# EAGLE design uNav4x4r1_PTH (EAGLE 6.5.0)
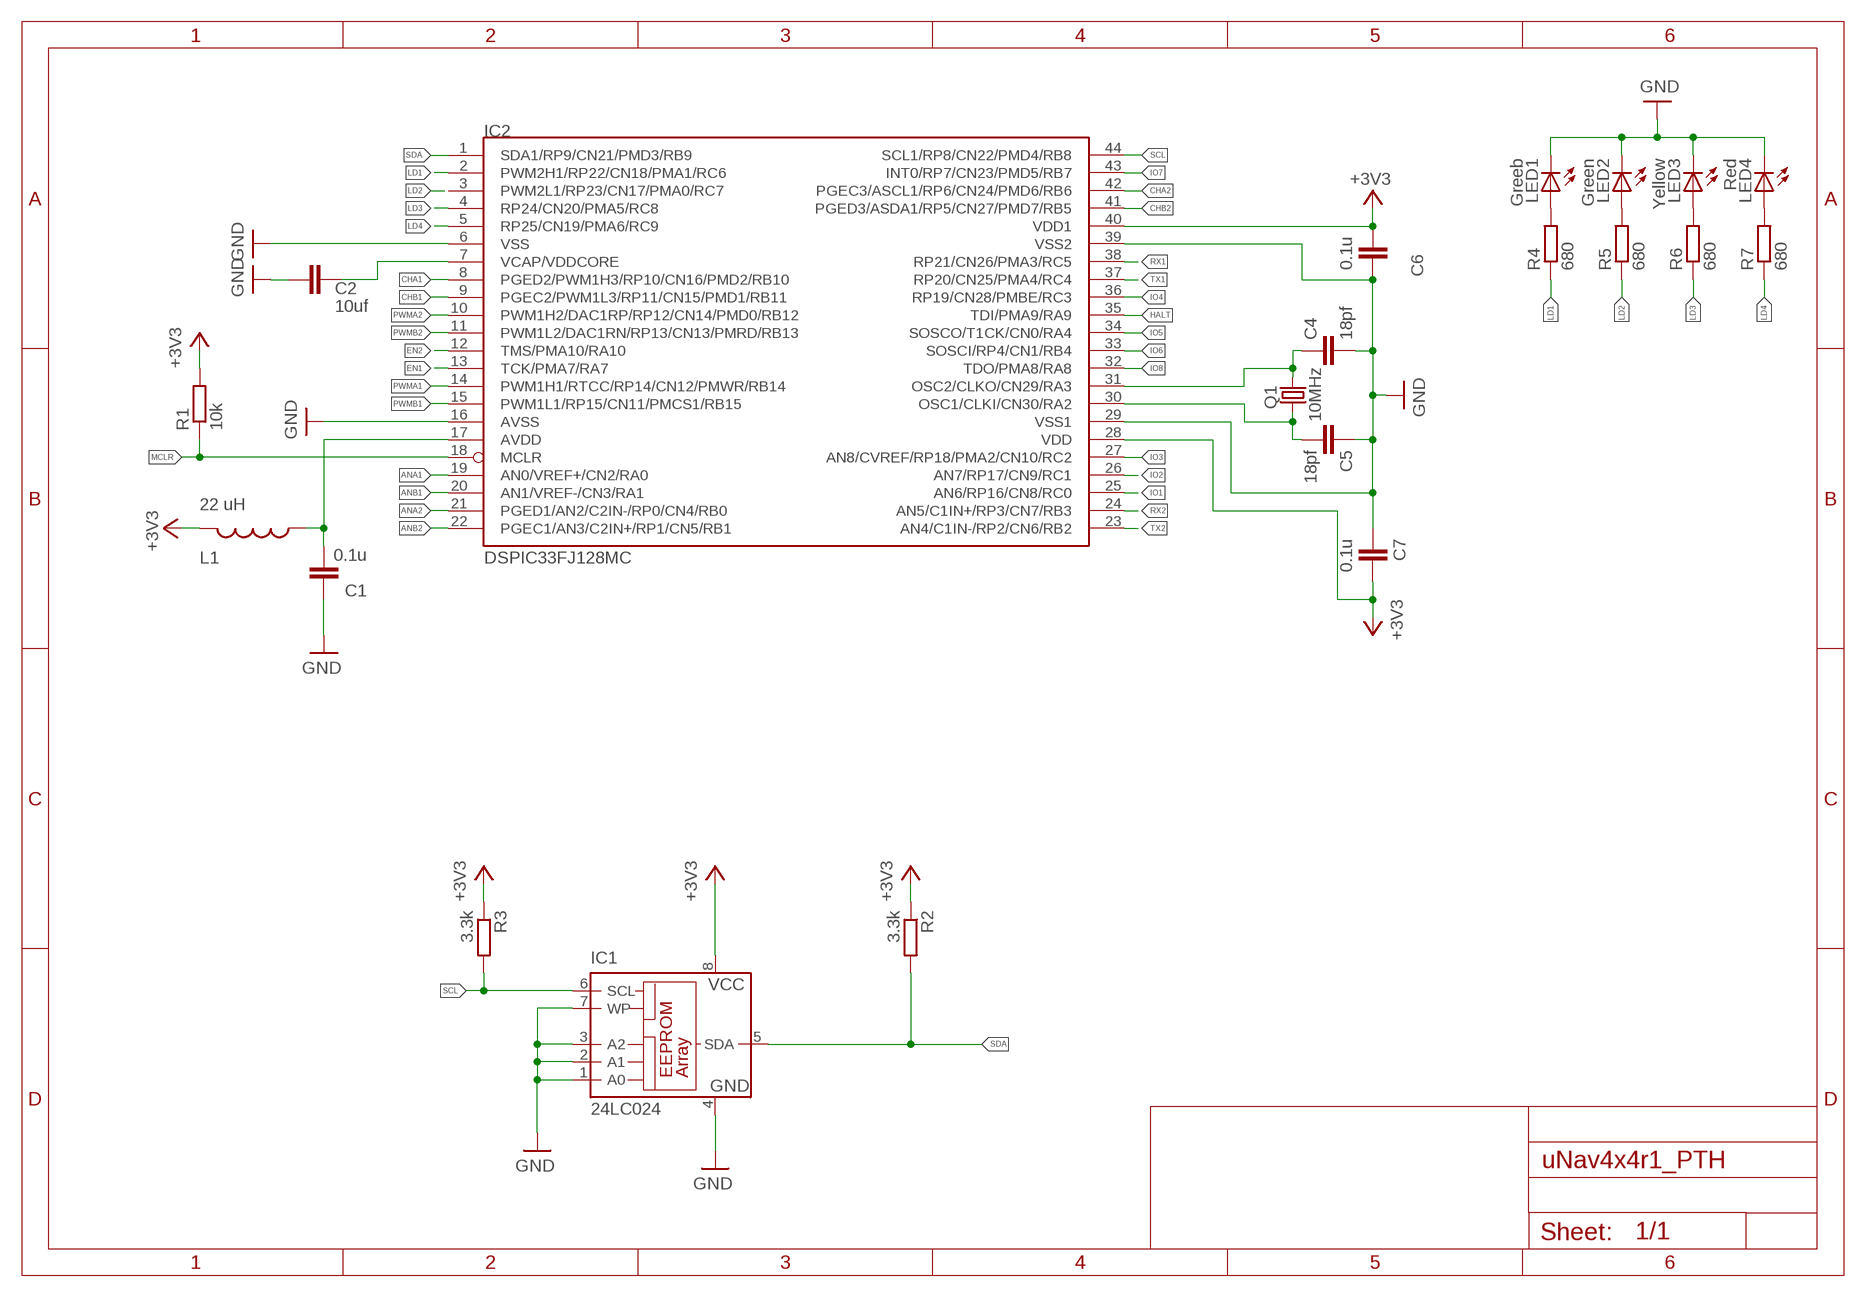
[diagram p0: schematic, sheet 1, part 1 of 2]
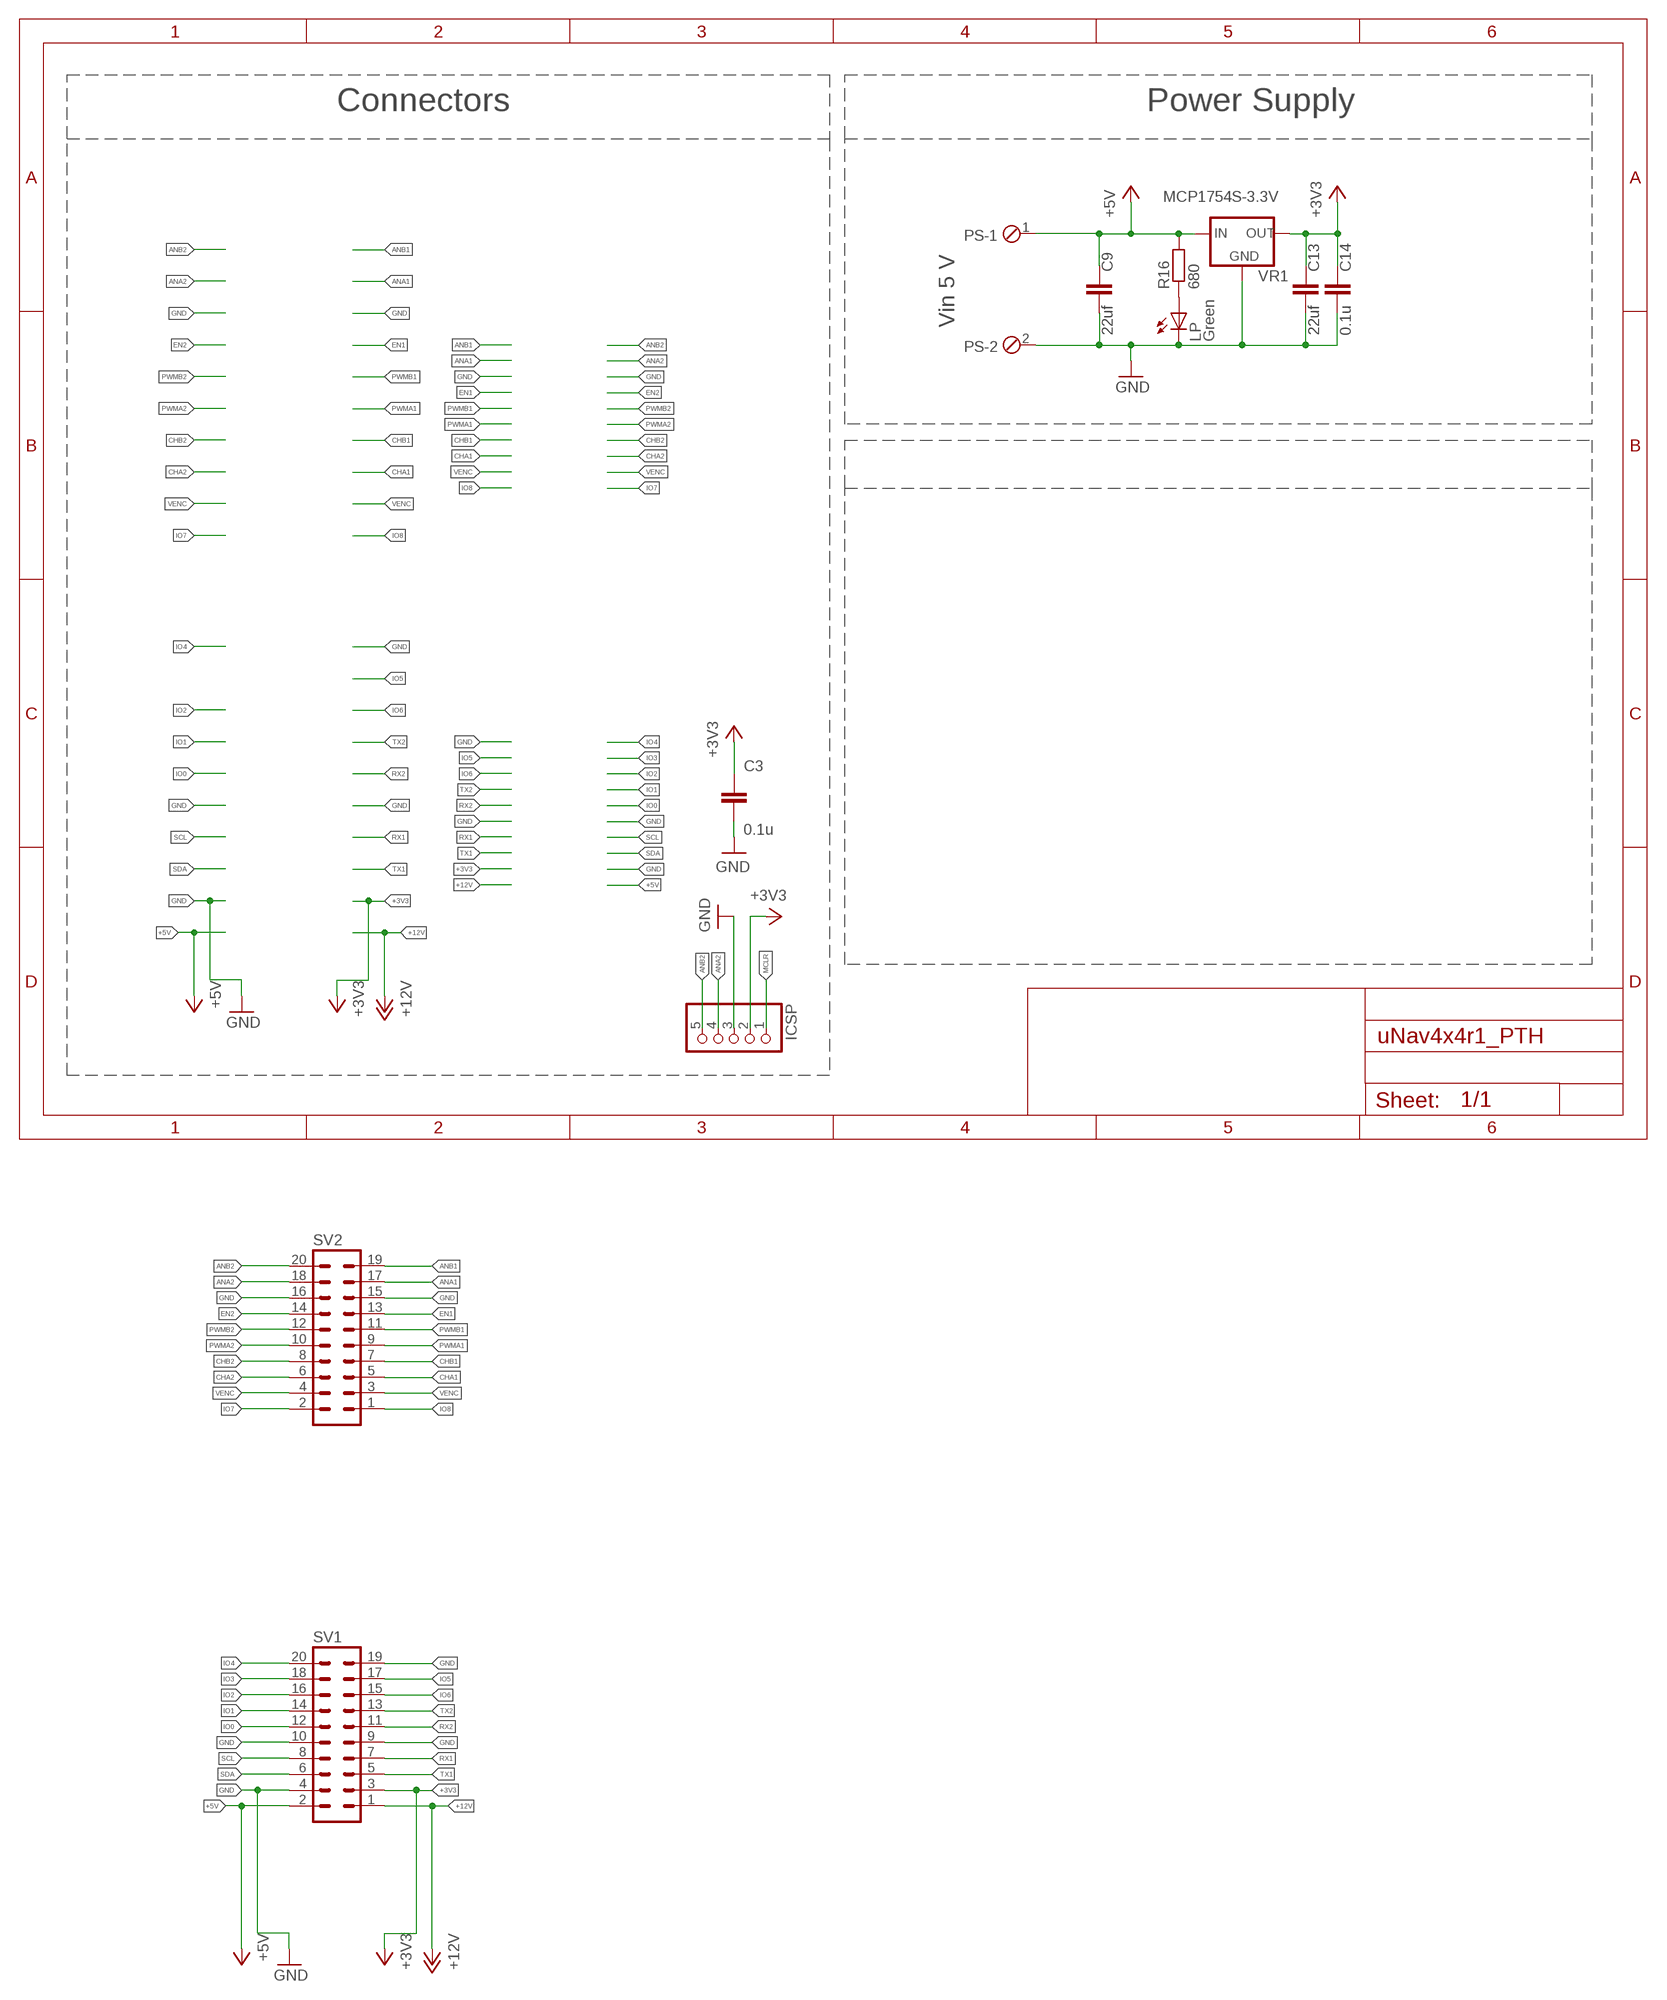
[diagram p1: schematic, sheet 1, part 2 of 2]

## Parts
C1  0.1u  C-EUC0603  [C0603]
C2  10uf  C-EUC1206  [C1206]
C3  0.1u  C-EUC0603  [C0603]
C4  18pf  C-EUC0603  [C0603]
C5  18pf  C-EUC0603  [C0603]
C6  0.1u  C-EUC0603  [C0603]
C7  0.1u  C-EUC0603  [C0603]
C9  22uf  C-EUC1206  [C1206]
C13  22uf  C-EUC1206  [C1206]
C14  0.1u  C-EUC0603  [C0603]
IC1  24LC024  24AA01SM  [SO-08M]
IC2  DSPIC33FJ128MC  DSPIC33FJ128MC804-PT  [TQFP44]
ICSP  PINHD-1X05_2.54-S  [1X05-S]
L1  22 uH  INDUCTOR0805  [0805]
LED1  Greeb  LEDCHIPLED_0805  [CHIPLED_0805]
LED2  Green  LEDCHIPLED_0805  [CHIPLED_0805]
LED3  Yellow  LEDCHIPLED_0805  [CHIPLED_0805]
LED4  Red  LEDCHIPLED_0805  [CHIPLED_0805]
LP  Green  LEDCHIPLED_0805  [CHIPLED_0805]
PS  MPT2  [2POL254]
Q1  10MHz  CRYSTALHC49U-V  [HC49U-V]
R1  10k  R-EU_R0603  [R0603]
R2  3.3k  R-EU_R0603  [R0603]
R3  3.3k  R-EU_R0603  [R0603]
R4  680  R-EU_R0603  [R0603]
R5  680  R-EU_R0603  [R0603]
R6  680  R-EU_R0603  [R0603]
R7  680  R-EU_R0603  [R0603]
R16  680  R-EU_R0603  [R0603]
SV1  MA10-2  [MA10-2]
SV2  MA10-2  [MA10-2]
VR1  MCP1754S-3.3V  MCP1754S  [SOT89]

## Nets
+3V3: C3.1 C6.2 C7.1 C13.1 C14.1 IC1.8(VCC) IC2.28(VDD) IC2.40(VDD1) ICSP.2 L1.2 R1.2 R2.1 R3.1 SV1.3 VR1.3(OUT)
+5V: C9.1 PS.1 R16.2 SV1.2 VR1.1(IN)
+12V: SV1.1
ANA1: IC2.19(AN0/VREF+/CN2/RA0) SV2.17
ANA2: IC2.21(PGED1/AN2/C2IN-/RP0/CN4/RB0) ICSP.4 SV2.18
ANB1: IC2.20(AN1/VREF-/CN3/RA1) SV2.19
ANB2: IC2.22(PGEC1/AN3/C2IN+/RP1/CN5/RB1) ICSP.5 SV2.20
AVDD: C1.2 IC2.17(AVDD) L1.1
CHA1: IC2.8(PGED2/PWM1H3/RP10/CN16/PMD2/RB10) SV2.5
CHA2: IC2.42(PGEC3/ASCL1/RP6/CN24/PMD6/RB6) SV2.6
CHB1: IC2.9(PGEC2/PWM1L3/RP11/CN15/PMD1/RB11) SV2.7
CHB2: IC2.41(PGED3/ASDA1/RP5/CN27/PMD7/RB5) SV2.8
EN1: IC2.13(TCK/PMA7/RA7) SV2.13
EN2: IC2.12(TMS/PMA10/RA10) SV2.14
GND: C1.1 C2.2 C3.2 C4.2 C5.1 C6.1 C7.2 C9.2 C13.2 C14.2 IC1.1(A0) IC1.2(A1) IC1.3(A2) IC1.4(GND) IC1.7(WP) IC2.6(VSS) IC2.16(AVSS) IC2.29(VSS1) IC2.39(VSS2) ICSP.3 LED1.C LED2.C LED3.C LED4.C LP.C PS.2 SV1.4 SV1.9 SV1.10 SV1.19 SV2.15 SV2.16 VR1.2(GND) VR1.4(GND)
HALT: IC2.35(TDI/PMA9/RA9)
IO0: SV1.12
IO1: IC2.25(AN6/RP16/CN8/RC0) SV1.14
IO2: IC2.26(AN7/RP17/CN9/RC1) SV1.16
IO3: IC2.27(AN8/CVREF/RP18/PMA2/CN10/RC2) SV1.18
IO4: IC2.36(RP19/CN28/PMBE/RC3) SV1.20
IO5: IC2.34(SOSCO/T1CK/CN0/RA4) SV1.17
IO6: IC2.33(SOSCI/RP4/CN1/RB4) SV1.15
IO7: IC2.43(INT0/RP7/CN23/PMD5/RB7) SV2.2
IO8: IC2.32(TDO/PMA8/RA8) SV2.1
LD1: IC2.2(PWM2H1/RP22/CN18/PMA1/RC6) R4.1
LD2: IC2.3(PWM2L1/RP23/CN17/PMA0/RC7) R5.1
LD3: IC2.4(RP24/CN20/PMA5/RC8) R6.1
LD4: IC2.5(RP25/CN19/PMA6/RC9) R7.1
MCLR: IC2.18(MCLR) ICSP.1 R1.1
N$2: C5.2 IC2.30(OSC1/CLKI/CN30/RA2) Q1.1
N$3: C4.1 IC2.31(OSC2/CLKO/CN29/RA3) Q1.2
N$5: LP.A R16.1
N$12: LED1.A R4.2
N$13: LED2.A R5.2
N$14: LED3.A R6.2
N$15: LED4.A R7.2
PWMA1: IC2.14(PWM1H1/RTCC/RP14/CN12/PMWR/RB14) SV2.9
PWMA2: IC2.10(PWM1H2/DAC1RP/RP12/CN14/PMD0/RB12) SV2.10
PWMB1: IC2.15(PWM1L1/RP15/CN11/PMCS1/RB15) SV2.11
PWMB2: IC2.11(PWM1L2/DAC1RN/RP13/CN13/PMRD/RB13) SV2.12
RX1: IC2.38(RP21/CN26/PMA3/RC5) SV1.7
RX2: IC2.24(AN5/C1IN+/RP3/CN7/RB3) SV1.11
SCL: IC1.6(SCL) IC2.44(SCL1/RP8/CN22/PMD4/RB8) R3.2 SV1.8
SDA: IC1.5(SDA) IC2.1(SDA1/RP9/CN21/PMD3/RB9) R2.2 SV1.6
TX1: IC2.37(RP20/CN25/PMA4/RC4) SV1.5
TX2: IC2.23(AN4/C1IN-/RP2/CN6/RB2) SV1.13
VCAP/VDDCORE: C2.1 IC2.7(VCAP/VDDCORE)
VENC: SV2.3 SV2.4

## Notes on the sheet
- Connectors | Power Supply
- Vin 5 V

## Library data of the parts
C1-C7 C9 C13 C14 = rcl:C-EU: CAPACITOR, European symbol
IC1 = microchip:24*: Serial EEPROM I2C; MF: MICROCHIP; MPN: 24AA01-I/SN; OC_FARNELL: 1331268; OC_NEWARK: 92C6793
IC2 = microchip-dspic33fjxxmc:DSPIC33FJ128MC804: dsPIC33FJ32MC302/304, dsPIC33FJ64MCX02/X04, AND dsPIC33FJ128MCX02/X04 High-Performance, 16-bit Digital Signal Controllers Package:44 Pin TQFP Operating Range: * Up to 40 MIPS operation (at 3.0V -3.6V): - Industrial temperature range (-40°C to +85°C) - Extended temperature range (-40°C to +125°C) High-Performance DSC CPU: * Modified Harvard architecture * C compiler optimized instruction set * 16-bit wide data path * 24-bit wide instructions * Linear program memory addressing up to 4M instruction words * Linear data memory addressing up to 64 Kbytes * 83 base instructions: mostly 1 word/1 cycle * Two 40-bit accumulators with rounding and saturation options * Flexible and powerful addressing modes: - Indirect - Modulo - Bit-Reversed * Software stack * 16 x 16 fractional/integer multiply operations * 32/16 and 16/16 divide operations * Single-cycle multiply and accumulate: - Accumulator write back for DSP operations - Dual data fetch * Up to ±16-bit shifts for up to 40-bit data Direct Memory Access (DMA): * 8-channel hardware DMA * Up to 2 Kbytes dual ported DMA buffer area (DMA RAM) to store data transferred via DMA: - Allows data transfer between RAM and a peripheral while CPU is executing code (no cycle stealing) * Most peripherals support DMA Timers/Capture/Compare/PWM: * Timer/Counters, up to five 16-bit timers: - Can pair up to make two 32-bit timers - One timer runs as a Real-Time Clock with an external 32.768 kHz oscillator - Programmable prescaler * Input Capture (up to four channels): - Capture on up, down or both edges - 16-bit capture input functions - 4-deep FIFO on each capture * Output Compare (up to four channels): - Single or Dual 16-bit Compare mode - 16-bit Glitchless PWM mode * Hardware Real-Time Clock/Calendar (RTCC): - Provides clock, calendar, and alarm functions Interrupt Controller: * 5-cycle latency * Up to 53 available interrupt sources * Up to three external interrupts * Seven programmable priority levels * Five processor exceptions Digital I/O: * Peripheral pin Select functionality * Up to 35 programmable digital I/O pins * Wake-up/Interrupt-on-Change for up to 31 pins * Output pins can drive from 3.0V to 3.6V * Up to 5V output with open drain configuration * All digital input pins are 5V tolerant * 4 mA sink on all I/O pins On-Chip Flash and SRAM: * Flash program memory (up to 128 Kbytes) * Data SRAM (up to 16 Kbytes) * Boot, Secure, and General Security for program Flash System Management: * Flexible clock options: - External, crystal, resonator, internal RC - Fully integrated Phase-Locked Loop (PLL) - Extremely low jitter PLL * Power-up Timer * Oscillator Start-up Timer/Stabilizer * Watchdog Timer with its own RC oscillator * Fail-Safe Clock Monitor * Reset by multiple sources Power Management: * On-chip 2.5V voltage regulator * Switch between clock sources in real time * Idle, Sleep, and Doze modes with fast wake-up Analog-to-Digital Converters (ADCs): * 10-bit, 1.1 Msps or 12-bit, 500 Ksps conversion: - Two and four simultaneous samples (10-bit ADC) - Up to nine input channels with auto-scanning - Conversion start can be manual or synchronized with one of four trigger sources - Conversion possible in Sleep mode - ±2 LSb max integral nonlinearity - ±1 LSb max differential nonlinearity Audio Digital-to-Analog Converter (DAC): - 16-bit Dual Channel DAC module - 100 Ksps maximum sampling rate - Second-Order Digital Delta-Sigma Modulator Comparator Module: * Two analog comparators with programmable input/output configuration CMOS Flash Technology: * Low-power, high-speed Flash technology * Fully static design * 3.3V (±10%) operating voltage * Industrial and Extended temperature * Low power consumption Motor Control Peripherals: * 6-channel 16-bit Motor Control PWM: - Three duty cycle generators - Independent or Complementary mode - Programmable dead-time and output polarity - Edge-aligned or center-aligned - Manual output override control - One Fault input - Trigger for ADC conversions - PWM frequency for 16-bit resolution (@ 40 MIPS) = 1220 Hz for Edge-Aligned mode, 610 Hz for Center-Aligned mode - PWM frequency for 11-bit resolution (@ 40 MIPS) = 39.1 kHz for Edge-Aligned mode, 19.55 kHz for Center-Aligned mode * 2-channel 16-bit Motor Control PWM: - One duty cycle generator - Independent or Complementary mode - Programmable dead time and output polarity - Edge-aligned or center-aligned - Manual output override control - One Fault input - Trigger for ADC conversions - PWM frequency for 16-bit resolution (@ 40 MIPS) = 1220 Hz for Edge-Aligned mode, 610 Hz for Center-Aligned mode - PWM frequency for 11-bit resolution (@ 40 MIPS) = 39.1 kHz for Edge-Aligned mode, 19.55 kHz for Center-Aligned mode * 2-Quadrature Encoder Interface module: - Phase A, Phase B, and index pulse input - 16-bit up/down position counter - Count direction status - Position Measurement (x2 and x4) mode - Programmable digital noise filters on inputs - Alternate 16-bit Timer/Counter mode - Interrupt on position counter rollover/underflow
ICSP = pinhead-2:PINHD-1X05: PIN HEADER
L1 = SparkFun-Passives:INDUCTOR: Inductors Basic Inductor/Choke - 0603 and 1206. Footprints are not proven and vary greatly between part numbers. SRN6045- 33uH, 20% 1.4A SDR0403-560KL - 56uH, 10%, 500mA RMS/740mA peak
LED1-LED4 LP = led:LED: LED OSRAM: - CHIPLED LG R971, LG N971, LY N971, LG Q971, LY Q971, LO R971, LY R971 LH N974, LH R974 LS Q976, LO Q976, LY Q976 LO Q996 - Hyper CHIPLED LW Q18S LB Q993, LB Q99A, LB R99A - SideLED LS A670, LO A670, LY A670, LG A670, LP A670 LB A673, LV A673, LT A673, LW A673 LH A674 LY A675 LS A676, LA A676, LO A676, LY A676, LW A676 LS A679, LY A679, LG A679 - Hyper Micro SIDELED® LS Y876, LA Y876, LO Y876, LY Y876 LT Y87S - SmartLED LW L88C, LW L88S LB L89C, LB L89S, LG L890 LS L89K, LO L89K, LY L89K LS L896, LA L896, LO L896, LY L896 - TOPLED LS T670, LO T670, LY T670, LG T670, LP T670 LSG T670, LSP T670, LSY T670, LOP T670, LYG T670 LG T671, LOG T671, LSG T671 LB T673, LV T673, LT T673, LW T673 LH T674 LS T676, LA T676, LO T676, LY T676, LB T676, LH T676, LSB T676, LW T676 LB T67C, LV T67C, LT T67C, LS T67K, LO T67K, LY T67K, LW E67C LS E67B, LA E67B, LO E67B, LY E67B, LB E67C, LV E67C, LT E67C LW T67C LS T679, LY T679, LG T679 LS T770, LO T770, LY T770, LG T770, LP T770 LB T773, LV T773, LT T773, LW T773 LH T774 LS E675, LA E675, LY E675, LS T675 LS T776, LA T776, LO T776, LY T776, LB T776 LHGB T686 LT T68C, LB T68C - Hyper Mini TOPLED® LB M676 - Mini TOPLED Santana® LG M470 LS M47K, LO M47K, LY M47K Source: http://www.osram.convergy.de LUXEON: - LUMILED® LXK2-PW12-R00, LXK2-PW12-S00, LXK2-PW14-U00, LXK2-PW14-V00 LXK2-PM12-R00, LXK2-PM12-S00, LXK2-PM14-U00 LXK2-PE12-Q00, LXK2-PE12-R00, LXK2-PE12-S00, LXK2-PE14-T00, LXK2-PE14-U00 LXK2-PB12-K00, LXK2-PB12-L00, LXK2-PB12-M00, LXK2-PB14-N00, LXK2-PB14-P00, LXK2-PB14-Q00 LXK2-PR12-L00, LXK2-PR12-M00, LXK2-PR14-Q00, LXK2-PR14-R00 LXK2-PD12-Q00, LXK2-PD12-R00, LXK2-PD12-S00 LXK2-PH12-R00, LXK2-PH12-S00 LXK2-PL12-P00, LXK2-PL12-Q00, LXK2-PL12-R00 Source: www.luxeon.com KINGBRIGHT: KA-3528ASYC Source: www.kingbright.com
PS = Personale:MPT2: PHOENIX CONNECTOR
Q1 = crystal:CRYSTAL: CRYSTAL; OC_FARNELL: 1666969; OC_NEWARK: unknown
R1-R7 R16 = rcl:R-EU_: RESISTOR, European symbol
SV1 SV2 = con-lstb:MA10-2: PIN HEADER; OC_FARNELL: unknown; OC_NEWARK: unknown
VR1 = Personale:MCP1754S

## Net classes
0 default: width 0.203 mm, clearance 0.203 mm
1 power: width 0.305 mm, clearance 0.203 mm

## Board
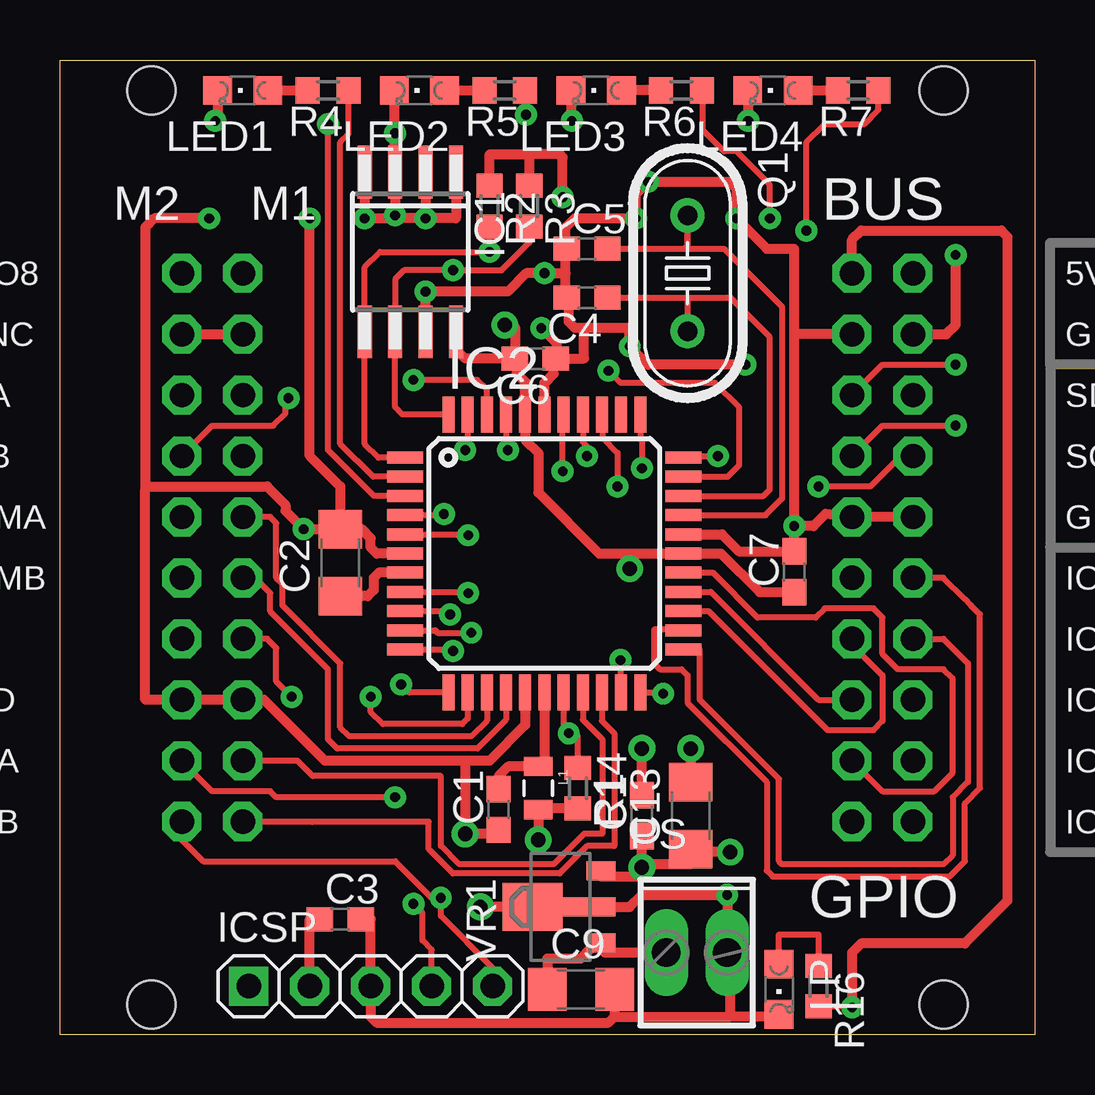
[diagram p2: board, top side]
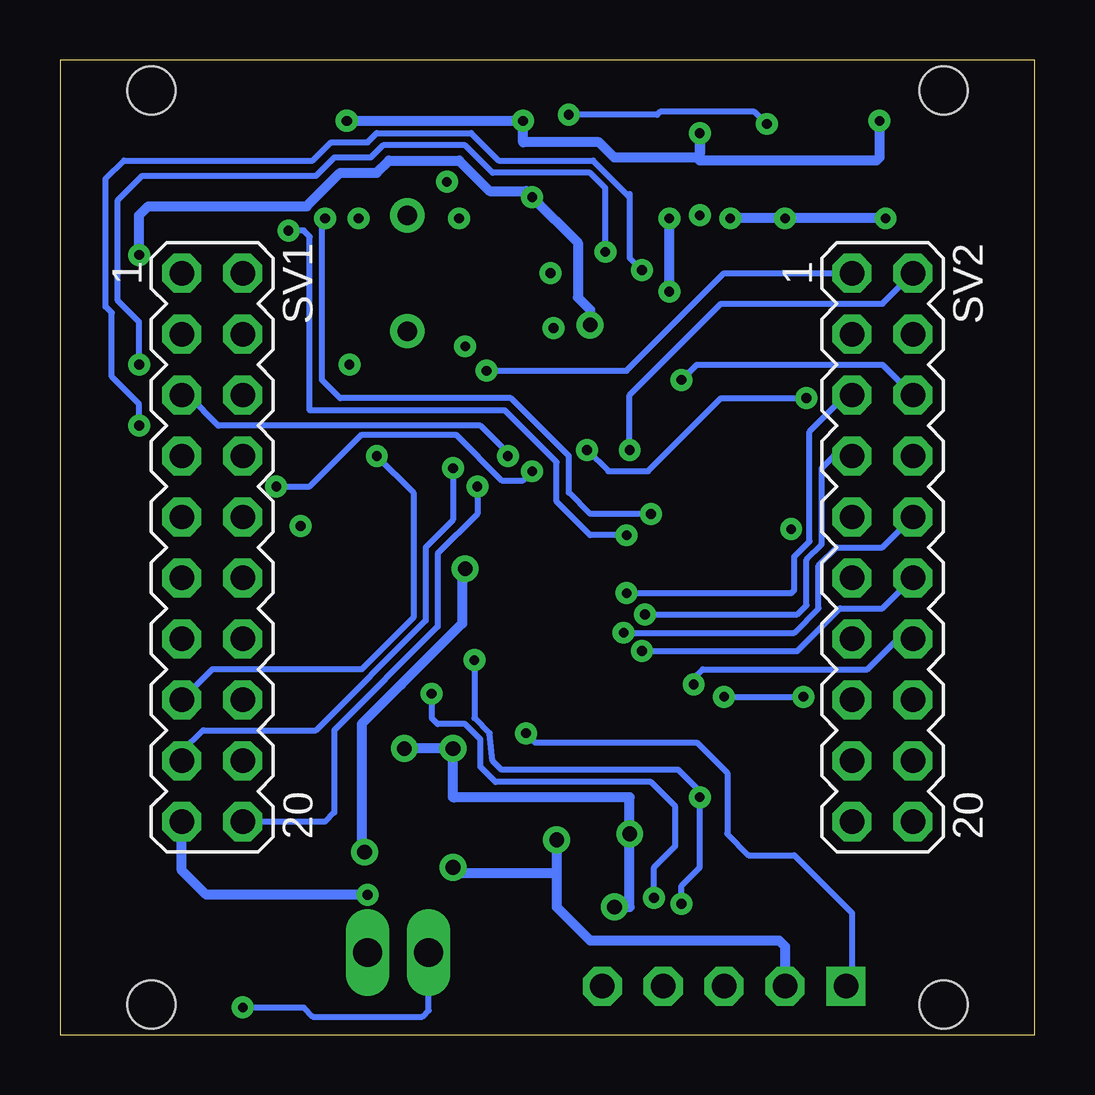
[diagram p3: board, bottom side, seen from below]

Size 40.64 x 40.64 mm. Coordinates in mm from the lower left corner, seen from the top.
Outline: 40.64,40.64 40.64,0 0,0 0,40.64 40.64,40.64
Copper layers (1*16): Top 0.035mm / dielectric 1.5mm / Bottom 0.035mm
Design rules "default": minimum track width 8mil, minimum drill 20mil, track to track 8mil, track to pad 8mil, pad to pad 8mil, via to via 8mil, smd to smd 8mil, copper to edge 10mil, drill to drill 8mil, minimum pad ring 12mil, minimum via ring 10mil, stop-mask expansion 4mil, vias tented up to drill 20mil, thermal gap 10mil
Holes 2 mm at 3.81,39.37 36.83,1.27 36.83,39.37 3.81,1.27
tRestrict: area -0.3,-1.9 to 42.9,0.6; area -0.3,41.9 to 42.9,44.5; area -1.9,0 to 0.6,43.2; area 41.6,0 to 44.1,43.2
bRestrict: area -1.9,0 to 0.6,43.2; area 41.6,0 to 44.1,43.2; area -0.3,-1.9 to 42.9,0.6; area -0.3,41.9 to 42.9,44.5

### Footprints (pad centres in the part's own frame; a part is rotated, then mirrored left to right if it is on the bottom)
C0603 = smd 1.1 x 1: 1 -0.85,0; 2 0.85,0
C1206 = smd 1.6 x 1.8: 1 -1.4,0; 2 1.4,0
SO-08M = smd 0.6 x 2.2: 1 -1.905,-3.33; 2 -0.635,-3.33; 3 0.635,-3.33; 4 1.905,-3.33; 5 1.905,3.33; 6 0.635,3.33; 7 -0.635,3.33; 8 -1.905,3.33
TQFP44 = smd 1.5 x 0.5: 1 -5.8,4; 2 -5.8,3.2; 3 -5.8,2.4; 4 -5.8,1.6; 5 -5.8,0.8; 6 -5.8,0; 7 -5.8,-0.8; 8 -5.8,-1.6; 9 -5.8,-2.4; 10 -5.8,-3.2; 11 -5.8,-4; 23 5.8,-4; 24 5.8,-3.2; 25 5.8,-2.4; 26 5.8,-1.6; 27 5.8,-0.8; 28 5.8,0; 29 5.8,0.8; 30 5.8,1.6; 31 5.8,2.4; 32 5.8,3.2; 33 5.8,4 | smd 0.5 x 1.5: 12 -4,-5.8; 13 -3.2,-5.8; 14 -2.4,-5.8; 15 -1.6,-5.8; 16 -0.8,-5.8; 17 0,-5.8; 18 0.8,-5.8; 19 1.6,-5.8; 20 2.4,-5.8; 21 3.2,-5.8; 22 4,-5.8; 34 4,5.8; 35 3.2,5.8; 36 2.4,5.8; 37 1.6,5.8; 38 0.8,5.8; 39 0,5.8; 40 -0.8,5.8; 41 -1.6,5.8; 42 -2.4,5.8; 43 -3.2,5.8; 44 -4,5.8
1X05-S = drill 1.016 square: 1 -5.08,0 | drill 1.016 octagon: 2 -2.54,0; 3 0,0; 4 2.54,0; 5 5.08,0
0805 = smd 0.8 x 1.2: 1 -0.9,0; 2 0.9,0
CHIPLED_0805 = smd 1.2 x 1.2: A 0,-1.05; C 0,1.05
2POL254 = drill 1.2 long: 1 -1.27,0; 2 1.27,0
HC49U-V = drill 0.813: 1 -2.413,0; 2 2.413,0
R0603 = smd 1 x 1.1: 1 -0.85,0; 2 0.85,0
MA10-2 = drill 1.016 octagon: 1 -11.43,-1.27; 2 -11.43,1.27; 3 -8.89,-1.27; 4 -8.89,1.27; 5 -6.35,-1.27; 6 -6.35,1.27; 7 -3.81,-1.27; 8 -3.81,1.27; 9 -1.27,-1.27; 10 -1.27,1.27; 11 1.27,-1.27; 12 1.27,1.27; 13 3.81,-1.27; 14 3.81,1.27; 15 6.35,-1.27; 16 6.35,1.27; 17 8.89,-1.27; 18 8.89,1.27; 19 11.43,-1.27; 20 11.43,1.27
SOT89 = smd 0.8 x 1.2: 1 -1.5,-1.6; 3 1.5,-1.6 | smd 0.8 x 2.3: 2 0,-1.05 | smd 2 x 2.5: 4 0,1.25

### Placement (x,y rotation side)
C1  18.29,9.4 90 top
C2  11.68,19.68 90 top
C3  11.68,4.83 0 top
C4  21.97,30.73 180 top
C5  21.97,32.77 0 top
C6  19.81,28.19 180 top
C7  30.61,19.3 90 top
C9  21.72,1.91 0 top
C13  26.29,9.14 90 top
C14  24.26,9.14 90 top
IC1  14.61,32.64 180 top
IC2  20.19,20.07 0 top
ICSP  12.95,2.03 0 top
L1  19.94,10.29 270 top
LED1  7.62,39.37 90 top
LED2  14.99,39.37 90 top
LED3  22.35,39.37 90 top
LED4  29.72,39.37 90 top
LP  29.97,1.91 180 top
PS  26.54,3.43 0 top
Q1  26.16,31.75 270 top
R1  21.59,10.29 270 top
R2  17.91,34.54 270 top
R3  19.56,34.54 270 top
R4  11.18,39.37 180 top
R5  18.54,39.37 180 top
R6  25.91,39.37 180 top
R7  33.27,39.37 180 top
R16  31.62,2.03 270 top
SV1  34.29,20.32 270 bottom
SV2  6.35,20.32 270 bottom
VR1  20.95,5.33 90 top

### Tracks (layer width: path | path; a pad name or v marks a point on that pad's centre or on a via)
+3V3  (via drill 0.41, 0.61)
  Top 0.254: R2.1 17.95,35.43
  Top 0.406: C6.2 19.05,28.11 19.05,27.56 19.39,27.22 IC2.40 19.39,24.8 19.94,24.26 19.94,22.61 22.48,20.07 23.75,20.07 | C6.2 16.89,28.19 16.51,28.57 IC1.8 | 24.26,7.11 26.29,7.11 C13.1 26.41,7.62 v27.94,7.62 | 24.26,7.11 C14.1 v24.26,6.99 | VR1.3 22.55,6.6 24.26,6.6 v24.26,6.99 | v24.26,6.99 24.26,7.11 | R2.1 17.91,36.7 19.56,36.7 | 19.56,36.7 R3.1 | R1.2 19.99,9.44 L1.2 v19.94,8.13 | ICSP.2 10.41,4.83 C3.1 | 23.75,20.07 IC2.28 27.56,20.07 29.17,18.45 C7.1 | v20.95,34.92 20.95,36.58 20.83,36.7 19.56,36.7 | v18.54,29.59 18.96,29.5 C6.2 | 23.75,20.07 v23.75,19.43 | SV1.3 36.96,29.21 37.34,29.59 v37.34,32.51
  Bottom 0.406: v19.94,8.13 19.94,6.86 | 19.94,6.86 20.07,6.73 24,6.73 v24.26,6.99 | v18.54,29.59 18.54,30.23 19.05,30.73 19.05,33.02 v20.95,34.92 21.21,35.18 22.73,35.18 24,36.45 26.92,36.45 27.43,35.94 28.96,35.94 30.35,34.54 36.96,34.54 37.34,34.16 v37.34,32.51 | 19.94,6.86 19.94,5.33 18.54,3.94 10.67,3.94 10.41,3.68 ICSP.2 | v23.75,19.43 23.88,19.43 23.88,17.14 26.42,14.61 28.07,12.95 28.07,7.75 v27.94,7.62
+5V  (via drill 0.41)
  Top 0.254: R16.2 32.98,1.18 v33.02,1.14
  Top 0.406: C9.1 20.32,1.53 20.32,3.17 21.72,3.17 22.12,3.58 VR1.1 22.71,3.43 PS.1 | SV1.2 33.02,33.15 33.4,33.53 39.24,33.53 39.5,33.27 39.5,5.59 37.72,3.81 33.4,3.81 33.02,3.43 v33.02,1.14
  Bottom 0.254: v33.02,1.14 30.48,1.14 30.1,0.76 25.53,0.76 25.27,1.02 PS.1
ANA1
  Top 0.254: IC2.19 21.79,13.13 22.61,12.32 22.61,8.38 21.84,8.38 20.57,7.11 16.64,7.11 15.88,7.87 15.88,10.79 10.54,10.79 9.91,11.43 SV2.17
ANA2  (via drill 0.41)
  Top 0.254: IC2.21 23.39,15.6 v23.37,15.62 | ICSP.4 15.49,3.56 15.11,3.94 15.11,5.08 v14.73,5.46 | v13.97,9.91 9.02,9.91 8.76,10.16 6.35,10.16 SV2.18
  Bottom 0.254: v23.37,15.62 23.37,13.21 22.73,12.57 22.61,11.43 22.23,11.05 14.86,11.05 13.97,10.16 v13.97,9.91 13.97,6.99 14.73,6.22 v14.73,5.46
ANB1
  Top 0.254: IC2.20 22.59,13.09 23.11,12.57 23.11,7.87 21.97,7.87 20.83,6.73 16.38,6.73 15.37,7.75 15.37,8.89 10.54,8.89 10.53,8.88 7.63,8.88 SV2.19
ANB2  (via drill 0.41)
  Top 0.254: IC2.22 25.1,14.27 v25.15,14.22 | ICSP.5 18.03,2.79 15.88,4.95 v15.88,5.71 15.49,5.71 13.97,7.24 5.97,7.24 5.08,8.13 SV2.20
  Bottom 0.254: v25.15,14.22 25.15,13.21 24.89,12.95 23.75,12.95 23.11,12.32 23.11,11.18 22.48,10.54 16,10.54 14.99,9.53 14.99,7.87 15.88,6.99 v15.88,5.71
AVDD
  Top 0.406: IC2.17 20.19,11.44 L1.1 18.68,11.19 18.29,10.79 C1.2
CHA1  (via drill 0.41)
  Top 0.254: IC2.8 16.94,18.47 v17.02,18.41
  Bottom 0.254: v17.02,18.41 10.16,18.41 10.03,18.54 10.03,19.94 9.4,20.57 9.4,25.15 7.87,26.67 SV2.5
CHA2  (via drill 0.41)
  Top 0.254: IC2.42 17.79,26.91 17.4,27.3 v14.73,27.3
  Bottom 0.254: SV2.6 6.35,27.94 14.1,27.94 v14.73,27.3
CHB1  (via drill 0.41)
  Top 0.254: IC2.9 16.12,17.67 v16.26,17.53
  Bottom 0.254: SV2.7 8.38,24.13 8.89,23.62 8.89,20.45 9.53,19.81 9.53,17.91 9.91,17.53 v16.26,17.53
CHB2  (via drill 0.41)
  Top 0.254: IC2.41 18.59,24.46 v18.67,24.38 | SV2.8 6.35,25.4 8.89,25.4 9.4,25.91 9.4,26.42 v9.53,26.54
  Bottom 0.254: v18.67,24.38 17.78,23.5 16.13,23.5 13.08,26.54 v9.53,26.54
EN1  (via drill 0.41)
  Top 0.254: IC2.13 16.99,13.18 16.76,12.95 13.46,12.95 12.95,13.46 v12.95,14.1 | v9.65,14.1 9.02,14.73 9.02,16.13 8.64,16.51 SV2.13
  Bottom 0.254: v12.95,14.1 v9.65,14.1
EN2  (via drill 0.41)
  Top 0.254: IC2.12 14.56,14.27 v14.22,14.61
  Bottom 0.254: v14.22,14.61 14.22,14.86 13.84,15.24 6.99,15.24 5.71,16.51 SV2.14
GND  (via drill 0.41, 0.61)
  Top 0.254: C5.1 21.08,32.77 | 21.08,31.11 C4.2
  Top 0.406: v28.57,27.94 24.51,27.94 v23.75,28.7 23.75,29.46 21.84,29.46 | 21.84,29.46 21.46,29.46 21.21,29.72 21.21,30.99 21.08,31.11 21.08,31.75 | 21.08,31.75 21.08,32.77 21.08,33.66 21.46,34.04 v24,34.04 24,35.05 v24.51,35.56 27.94,35.56 28.19,35.31 v28.19,34.04 29.46,32.77 30.61,32.77 30.61,29.21 | v13.97,34.16 IC1.3 13.94,36 13.94,38.1 | v13.97,34.16 13.97,34.04 | 13.97,34.04 14.1,34.04 | IC1.1 16.51,34.04 v15.24,34.04 15.11,34.04 | IC1.2 15.24,34.16 15.11,34.04 | IC1.4 v12.7,34.04 13.97,34.04 | LED1.C 6.57,38.35 v6.48,38.1 | LED2.C 13.94,38.1 | 13.94,38.1 v13.97,37.59 | LED3.C 21.3,38.1 v21.34,38.1 | LED4.C v28.67,38.1 v28.7,38.1 | IC2.29 27.6,20.87 28.31,20.15 C7.2 v30.61,21.21 | 21.08,31.75 v20.19,31.75 19.43,31.75 18.67,30.99 v15.24,30.99 IC1.7 | IC2.39 20.19,27.18 20.57,27.56 20.57,28.11 C6.1 | C6.1 21.84,28.19 21.84,29.46 | IC2.16 19.39,12.92 17.91,11.43 16.89,11.43 | 16.89,11.43 v16.89,8.38 17.78,8.38 C1.1 | C14.2 v24.26,11.94 | v26.29,11.94 C13.2 | 22.1,5.33 VR1.4 | VR1.4 VR1.2 21.88,5.37 21.97,5.21 22.1,5.33 | VR1.4 v17.53,5.33 | C9.2 23.12,0.76 | 23.12,0.76 27.94,0.76 | 27.94,0.76 27.94,3.43 PS.2 v27.81,5.84 24.26,5.84 23.75,5.33 22.1,5.33 | LP.C 29.97,0.76 27.94,0.76 | 15.11,34.04 14.1,34.04 | 14.1,34.04 v13.97,34.16 | v20.07,29.46 20.7,28.83 20.7,28.23 C6.1 | C3.2 12.95,4.83 ICSP.3 12.95,0.76 13.21,0.51 22.86,0.51 23.12,0.76 | 16.89,11.43 11.05,11.43 8.51,13.97 SV2.15 | SV2.15 SV2.16 | v10.41,34.04 10.41,24.13 11.68,22.86 C2.2 12.57,21.08 12.95,20.7 12.95,20.32 13.21,20.07 IC2.6 | SV2.15 3.56,13.97 3.56,22.73 | 3.56,22.73 3.68,22.86 8.64,22.86 9.4,22.1 9.4,21.84 v10.16,21.08 v10.16,21.09 C2.2
  Top 0.406: v6.22,34.04 3.94,34.04 3.56,33.66 3.56,22.73 | SV1.9 SV1.10 31.92,21.72 31.41,21.21 v30.61,21.21 | SV1.4 30.61,29.21 | v30.61,21.21 30.61,29.21
  Bottom 0.406: v26.29,11.94 v24.26,11.94 C14.2 24.17,9.91 | 24.17,9.91 16.89,9.91 v16.89,8.38 16.89,5.33 v17.53,5.33 | 24.26,9.91 24.17,9.91 | v15.24,30.99 v15.24,34.04 | v6.22,34.04 v10.41,34.04 v12.7,34.04 | v6.48,38.1 6.48,36.58 6.6,36.45 13.97,36.45 v13.97,37.59 13.97,36.7 14.1,36.58 17.53,36.58 18.16,37.21 21.34,37.21 v21.34,38.1 v28.67,38.1 | v27.81,5.84 34.54,5.84 35.56,6.86 SV1.19
IO1
  Top 0.254: SV1.14 33.02,16.26 34.29,14.99 34.29,13.08 33.91,12.7 32,12.7 27.04,17.67 IC2.25
IO2
  Top 0.254: IC2.26 27.13,18.47 31.62,13.97 SV1.16
IO3
  Top 0.254: SV1.18 34.29,10.16 36.45,10.16 37.21,10.92 37.21,14.86 36.83,15.24 34.92,15.24 34.29,15.88 34.29,17.4 33.91,17.78 31.88,17.78 31.5,17.4 29.08,17.4 27.22,19.27 IC2.27
IO4  (via drill 0.41)
  Top 0.254: IC2.36 22.61,25.85 22.61,24.89 23.24,24.26 v23.24,22.86
  Bottom 0.254: v23.24,22.86 23.24,21.72 24.89,20.07 24.89,17.02 29.21,12.7 29.21,9.27 29.59,8.89 SV1.20
IO5  (via drill 0.41)
  Top 0.254: IC2.34 24.19,24.83 24.26,24.77 v24.26,23.62
  Bottom 0.254: v24.26,23.62 24.26,21.46 25.4,20.32 25.4,17.27 29.97,12.7 34.67,12.7 35.56,11.81 SV1.17
IO6  (via drill 0.41)
  Top 0.254: IC2.33 25.99,24.09 25.82,24.09 25.78,24.13 v27.43,24.13
  Bottom 0.254: v27.43,24.13 25.91,22.61 25.91,17.4 28.07,15.24 34.29,15.24 SV1.15
IO7  (via drill 0.41)
  Top 0.254: IC2.43 16.99,24.49 v16.89,24.38
  Bottom 0.254: SV2.2 6.35,30.48 13.08,30.48 16.89,26.67 v16.89,24.38
IO8  (via drill 0.41)
  Top 0.254: IC2.32 27.84,23.27 28.32,23.75 28.32,26.16 27.3,27.18 23.37,27.18 v22.86,27.69
  Bottom 0.254: SV2.1 12.95,31.75 17.02,27.69 v22.86,27.69
LD1
  Top 0.254: IC2.2 13.06,23.27 11.68,24.64 11.68,37.21 12.03,37.55 R4.1
LD2  (via drill 0.41)
  Top 0.254: IC2.3 13.09,22.47 11.18,24.38 v11.18,37.97 | v19.43,38.35 19.39,38.39 R5.1
  Bottom 0.254: v11.18,37.97 11.68,38.48 15.62,38.48 15.75,38.35 v19.43,38.35
LD3  (via drill 0.41)
  Top 0.254: IC2.4 15.95,21.67 v16,21.72 | v29.59,34.04 29.59,35.43 28.19,36.83 27.69,36.83 26.8,37.72 26.8,39.33 R6.1
  Bottom 0.254: v16,21.72 18.54,21.72 19.43,22.61 19.43,24.13 21.84,26.54 28.96,26.54 29.72,27.3 29.72,33.91 v29.59,34.04
LD4  (via drill 0.41)
  Top 0.254: IC2.5 16.98,20.87 v17.02,20.83 | v31.11,33.53 31.11,37.21 31.88,37.97 33.53,37.97 34.12,38.57 R7.1
  Bottom 0.254: v17.02,20.83 18.54,20.83 19.94,22.23 19.94,23.88 22.1,26.04 30.23,26.04 30.23,33.27 30.48,33.53 v31.11,33.53
MCLR  (via drill 0.41)
  Top 0.254: IC2.18 20.99,12.79 v21.21,12.57 21.46,12.57 21.59,12.45 R1.1
  Bottom 0.254: v21.21,12.57 20.83,12.19 14.1,12.19 12.83,10.92 12.83,8.38 11.94,7.49 10.03,7.49 7.62,5.08 7.62,1.78 ICSP.1
N$2
  Top 0.254: C5.2 26.04,32.77 26.16,32.89 Q1.1 26.16,32.77 27.69,32.77 30.1,30.35 30.1,22.35 29.41,21.67 IC2.30
N$3
  Top 0.254: C4.1 26.16,30.73 | 26.16,30.73 Q1.2 | 26.16,30.73 27.94,30.73 29.59,29.08 29.59,22.73 29.32,22.47 IC2.31
N$5
  Top 0.254: LP.A 29.97,4.19 31.62,4.19 R16.1
N$12
  Top 0.406: LED1.A R4.2
N$13
  Top 0.406: LED2.A R5.2
N$14
  Top 0.406: R6.2 LED3.A
N$15
  Top 0.406: LED4.A R7.2
PWMA1
  Top 0.254: IC2.14 17.79,13.09 17.14,12.45 12.06,12.45 11.68,12.83 11.68,15.49 9.27,17.91 9.27,18.8 9.02,19.05 9.02,21.34 8.76,21.59 SV2.9
PWMA2  (via drill 0.41)
  Top 0.254: IC2.10 15.65,16.87 15.75,16.76 v17.14,16.76
  Bottom 0.254: v17.14,16.76 10.03,16.76 9.02,17.78 9.02,19.56 8.26,20.32 6.35,20.32 SV2.10
PWMB1
  Top 0.254: IC2.15 18.59,13.13 17.4,11.94 11.56,11.94 11.18,12.32 11.18,15.24 8.76,17.65 8.76,18.41 8.13,19.05 SV2.11
PWMB2  (via drill 0.41)
  Top 0.254: IC2.11 16.32,16.07 v16.38,16
  Bottom 0.254: v16.38,16 9.91,16 8.13,17.78 6.35,17.78 SV2.12
RX1  (via drill 0.41)
  Top 0.254: 35.69,24.13 SV1.7 35.05,24.13 33.78,22.86 v31.62,22.86 | v20.95,23.5 20.95,25.83 IC2.38
  Bottom 0.254: v31.62,22.86 30.23,22.86 28.07,25.02 24.13,25.02 22.23,23.11 21.34,23.11 v20.95,23.5
RX2
  Top 0.254: IC2.24 25.99,16.89 24.77,16.89 24.77,15.49 25.02,15.24 25.91,15.24 26.16,14.99 26.16,13.84 29.46,10.54 29.46,6.86 29.72,6.6 37.08,6.6 37.72,7.24 37.72,9.65 38.35,10.29 38.35,17.53 37.97,17.91 37.72,18.16 36.83,19.05 SV1.11
SCL  (via drill 0.41)
  Top 0.254: R3.2 19.56,33.02 18.41,31.88 v16.38,31.88 14.35,31.88 13.97,31.5 IC1.6 13.97,26.16 14.27,25.87 IC2.44 | SV1.8 34.29,25.4 v37.34,25.4
  Bottom 0.254: 16.89,34.92 18.41,36.45 22.35,36.45 23.5,37.59 27.43,37.59 27.81,37.21 29.34,37.21 30.1,36.45 37.97,36.45 38.73,35.69 38.73,30.35 38.48,30.1 38.48,27.43 37.34,26.29 v37.34,25.4 | 16.89,35.05 16.89,34.92 | 16.89,34.92 16.89,32.38 v16.38,31.88
SDA  (via drill 0.41)
  Top 0.254: R2.2 v17.91,32.64 13.34,32.64 12.7,32 IC1.5 12.7,24.64 13.27,24.07 IC2.1 | SV1.6 34.29,27.94 v37.34,27.94
  Bottom 0.254: v17.91,32.64 17.91,35.31 18.54,35.94 22.61,35.94 23.75,37.08 27.18,37.08 27.69,36.58 29.21,36.58 29.97,35.81 37.21,35.81 38.23,34.8 38.23,30.61 37.34,29.72 v37.34,27.94
TX1  (via drill 0.41)
  Top 0.254: IC2.37 21.79,24.71 21.97,24.51 v21.97,24.13
  Bottom 0.254: v21.97,24.13 21.97,24.26 23.11,25.4 34.04,25.4 35.31,26.67 SV1.5
TX2
  Top 0.254: SV1.13 36.83,16.51 37.85,15.49 37.85,10.54 37.21,9.91 37.21,7.49 36.83,7.11 30.1,7.11 29.97,7.24 29.97,10.67 26.67,13.97 26.67,16.07 IC2.23
VCAP/VDDCORE
  Top 0.406: IC2.7 13.3,19.27 13.08,19.05 13.08,18.54 12.83,18.29 C2.1
VENC
  Top 0.406: SV2.4 SV2.3

### Text on the board
tPlace: M2 | M1 | BUS | IO7 | IO8 | 5V | 12V | VENC | GND | 3v | CHA | SDA | TX1 | CHB | SCL | RX1 | PWMA | GND | GND | PWMB | IO0 | RX2 | EN | IO1 | TX2 | GND | IO2 | IO6 | AN A | IO3 | IO5 | AN B | IO4 | GND | GPIO